# EAGLE schematic basic_circuit (EAGLE 9.4.2)
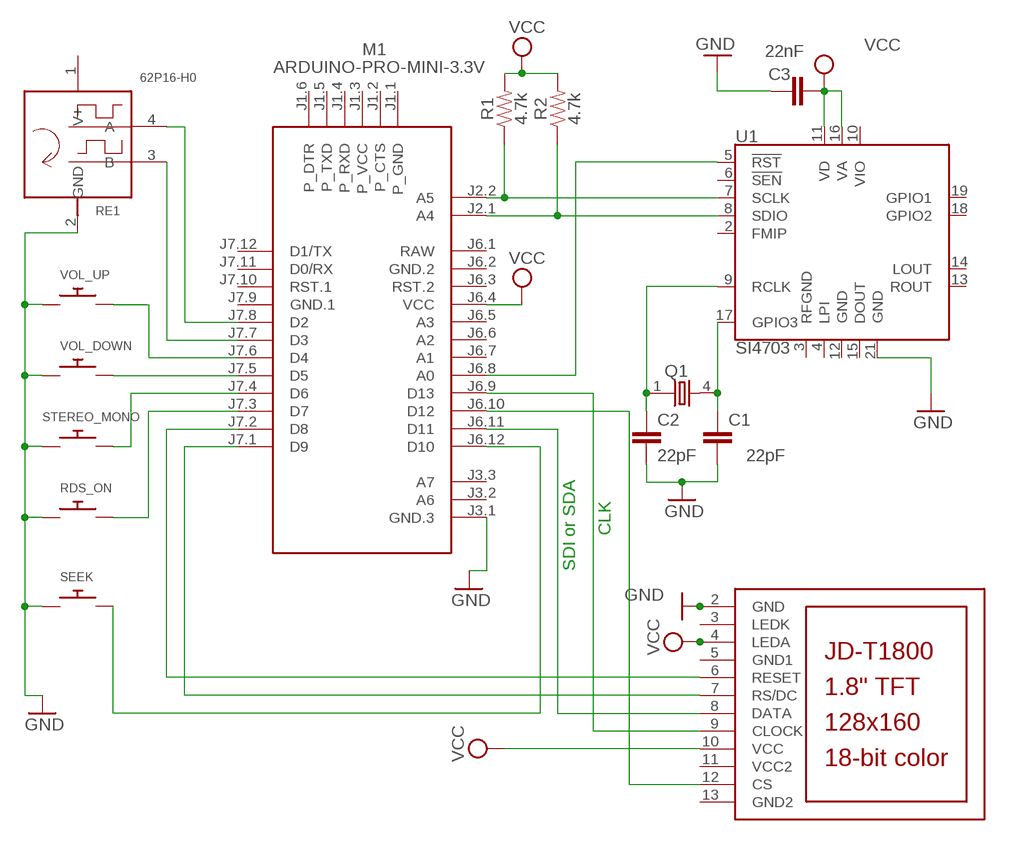
[diagram p0: schematic, sheet 1]

## Parts
C1  22pF  C2,5-3  [C2.5-3]
C2  22pF  C2,5-3  [C2.5-3]
C3  22nF  C2,5-3  [C2.5-3]
LCD1  JD-T1800  [JD-T1800]
M1  ARDUINO-PRO-MINI-3.3V  [ARDUINO-PRO-MINI]
Q1  86SMX  [86SMX]
R1  4.7k  4.7KOHM-0603-1/10W-1%  [0603]
R2  4.7k  4.7KOHM-0603-1/10W-1%  [0603]
RDS_ON  SWITCH_PUSHBUTTONC&K_KSS  [BTN_CK_KSS]
RE1  62P16-H0  [62P]
SEEK  SWITCH_PUSHBUTTONC&K_KSS  [BTN_CK_KSS]
STEREO_MONO  SWITCH_PUSHBUTTONC&K_KSS  [BTN_CK_KSS]
U1  SI4703  [QFN-20-3X3MM]
VOL_DOWN  SWITCH_PUSHBUTTONC&K_KSS  [BTN_CK_KSS]
VOL_UP  SWITCH_PUSHBUTTONC&K_KSS  [BTN_CK_KSS]

## Nets
GND: C1.2 C2.2 C3.1 LCD1.2(GND) M1.J3.1(GND.3) RDS_ON.P$1 RE1.2(GND) SEEK.P$1 STEREO_MONO.P$1 U1.21(GND) VOL_DOWN.P$1 VOL_UP.P$1
N$1: M1.J2.2(A5) R1.1 U1.7(SCLK)
N$2: M1.J2.1(A4) R2.1 U1.8(SDIO)
N$3: M1.J6.8(A0) U1.5(!RST)
N$4: C1.1 Q1.4 U1.17(GPIO3)
N$5: C2.1 Q1.1 U1.9(RCLK)
N$6: M1.J7.7(D3) RE1.3(B)
N$7: M1.J7.8(D2) RE1.4(A)
N$8: M1.J7.6(D4) VOL_UP.P$2
N$9: M1.J7.5(D5) VOL_DOWN.P$2
N$10: M1.J7.4(D6) STEREO_MONO.P$2
N$11: M1.J7.3(D7) RDS_ON.P$2
N$12: LCD1.6(RESET) M1.J7.2(D8)
N$13: LCD1.7(RS/DC) M1.J7.1(D9)
N$14: LCD1.8(DATA) M1.J6.11(D11)
N$15: LCD1.9(CLOCK) M1.J6.9(D13)
N$17: M1.J6.12(D10) SEEK.P$2
N$18: LCD1.12(CS) M1.J6.10(D12)
VCC: C3.2 LCD1.4(LEDA) LCD1.10(VCC) M1.J6.4(VCC) R1.2 R2.2 U1.11(VD) U1.16(VA)
Unconnected: LCD1.3(LEDK) M1.J1.1(P_GND) M1.J1.2(P_CTS) M1.J1.3(P_VCC) M1.J1.4(P_RXD) M1.J1.5(P_TXD) M1.J1.6(P_DTR) M1.J3.2(A6) M1.J3.3(A7) M1.J6.3(RST.2) M1.J6.5(A3) M1.J6.6(A2) M1.J6.7(A1) M1.J7.10(RST.1) M1.J7.11(D0/RX) M1.J7.12(D1/TX) RE1.1(V+) U1.2(FMIP) U1.3(RFGND) U1.4(LPI) U1.6(!SEN) U1.10(VIO) U1.12(GND) U1.13(ROUT) U1.14(LOUT) U1.15(DOUT) U1.18(GPIO2) U1.19(GPIO1)

## Notes on the sheet
- CLK
- SDI or SDA

## Power pins joined to a net without a drawn wire
GND1: LCD1.5(GND1)
GND2: LCD1.13(GND2)
GND.1: M1.J7.9(GND.1)
GND.2: M1.J6.2(GND.2)
RAW: M1.J6.1(RAW)
VCC2: LCD1.11(VCC2)

## Library data of the parts
C1-C3 = capacitor-wima:C: CAPACITOR naming: grid - package width
LCD1 = adafruit:JD-T1800
M1 = diy-modules:ARDUINO-PRO-MINI-*: Arduino Pro Mini and compatible devices More details available here: https://www.arduino.cc/en/Main/ArduinoBoardProMini Click here to find device on ebay.com <http://www.ebay.com/sch/arduino+pro+mini>
Q1 = crystal:86SMX: CRYSTAL; MF: C-MAC FREQUENCY PRODUCTS LTD; MPN: XTAL003321- 86SMX; OC_FARNELL: 6344914; OC_NEWARK: 01H9866
R1 R2 = SparkFun-Resistors:4.7KOHM: 4.7kΩ resistor A resistor is a passive two-terminal electrical component that implements electrical resistance as a circuit element. Resistors act to reduce current flow, and, at the same time, act to lower voltage levels within circuits. - Wikipedia; PROD_ID: RES-07857
RDS_ON SEEK STEREO_MONO VOL_DOWN VOL_UP = adafruit:SWITCH_PUSHBUTTON: Buttons SOFTTOUCHSMD_SJ - Soft touch temporary push button (Super Junk Akihabara) Compatible with SKPMANE010 [Mouser: 688-SKPMAN] C&K_KSS = Digikey: KSS221GLFS
RE1 = rotary-encoder:62P*0
U1 = SI4703:SI4703: Silicon Labs Si4703 FM Tuner Beyond enabling you to tune in to FM radio stations, the Si4703 is also capable of detecting and processing both Radio Data Service (RDS) and Radio Broadcast Data Service (RBDS) information. The Si4703 even does a very good job of filtering and carrier detection. It also enables data such as the station ID and song name to be displayed to the user. SparkFun Products SparkFun FM Tuner Evaluation Board - Si4703 <https://www.sparkfun.com/products/12938> (WRL-12938) SparkFun FM Tuner Basic Breakout - Si4703 <https://www.sparkfun.com/products/11083> (WRL-11083) FabFM Radio Kit <https://www.sparkfun.com/products/11043> (KIT-11043); AVAILABILITY: Unavailable; DESCRIPTION: - Tuner For Use With Si4703; MF: SparkFun Electronics; MP: SI4703; PACKAGE: UFQFN-20 SparkFun Electronics; PRICE: None